# Altium schematic sheet Power.SchDoc
size Letter; Organization: Altium Limited; Address1: L3, 12a Rodborough Rd; Address2: Frenchs Forest; Address3: NSW; Address4: Australia 2086
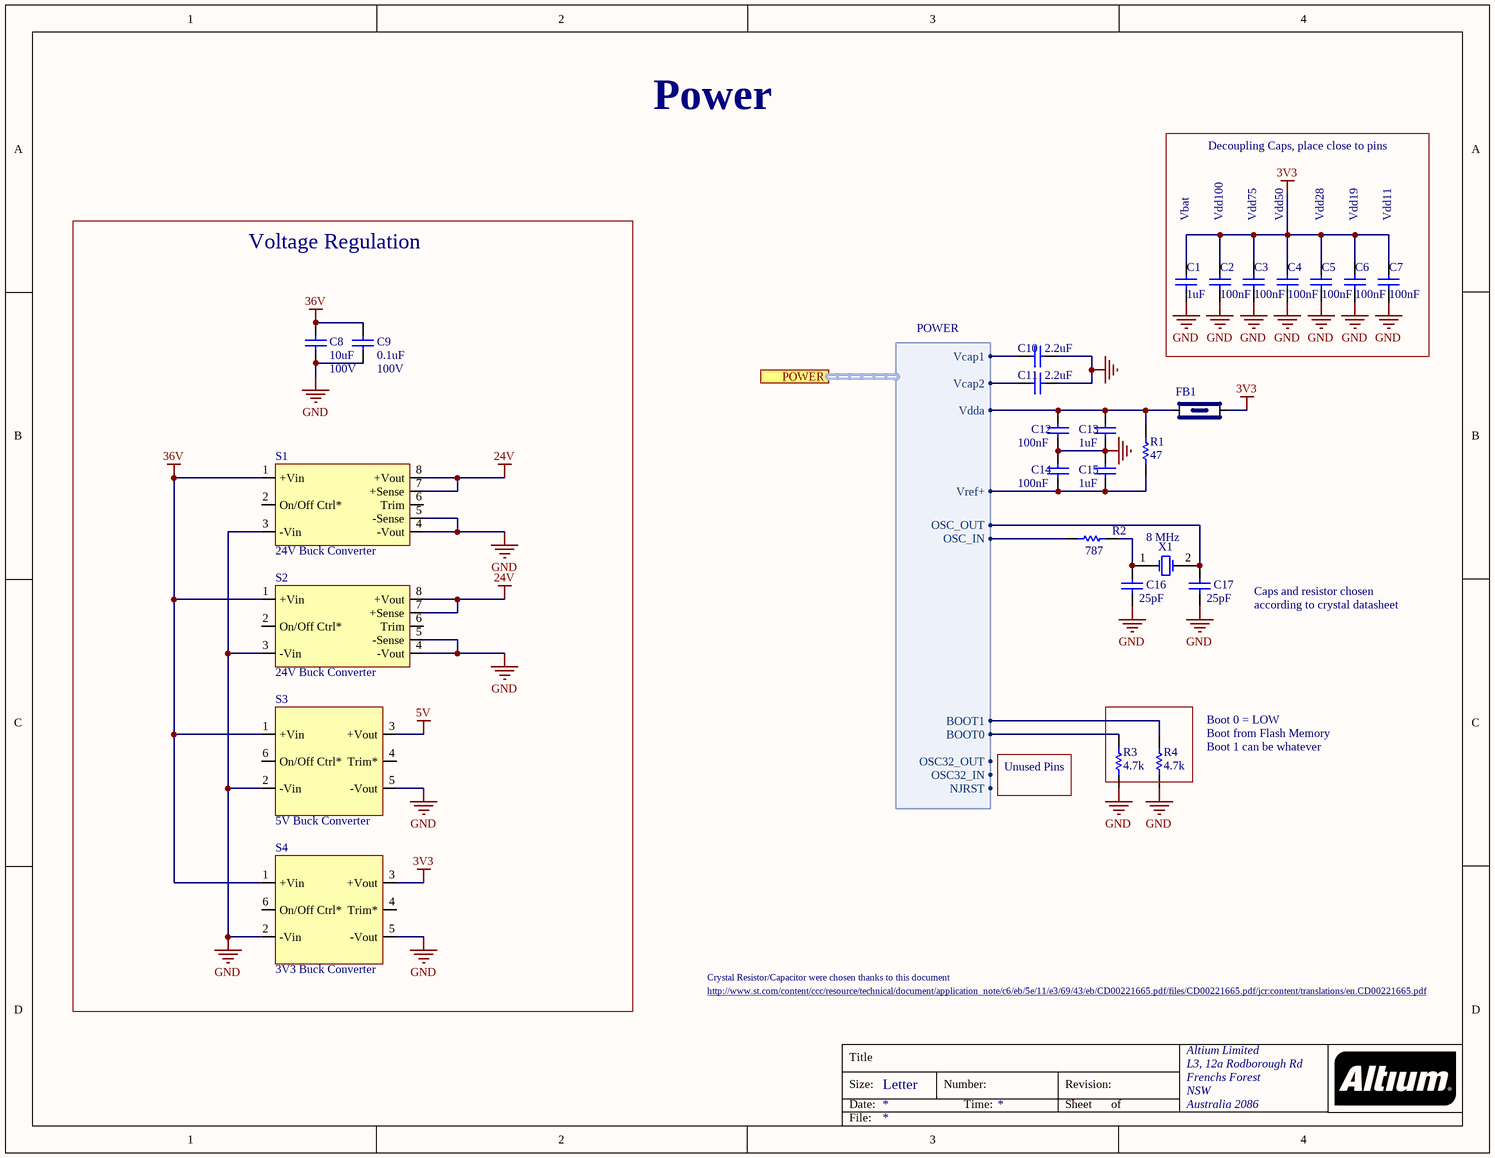
[diagram p0: Power.SchDoc]

## Parts
C1  value 1uF  [CAP_0603]
C2  value 100nF  [CAP_0603]
C3  value 100nF  [CAP_0603]
C4  value 100nF  [CAP_0603]
C5  value 100nF  [CAP_0603]
C6  value 100nF  [CAP_0603]
C7  value 100nF  [CAP_0603]
C8  value 10uF  Voltage: 100V  [2220]  (hidden comment: Cap)
C9  value 0.1uF  Voltage: 100V  [CAP_0603]  (hidden comment: Cap)
C10  value 2.2uF  [CAP_0603]
C11  value 2.2uF  [CAP_0603]
C12  value 100nF  [CAP_0603]
C13  value 1uF  [CAP_0603]
C14  value 100nF  [CAP_0603]
C15  value 1uF  [CAP_0603]
C16  value 25pF  [CAP_0603]
C17  value 25pF  [CAP_0603]
FB1  Ferrite Bead  [0603]  (value not drawn)
R1  value 47  [RES_0603]  (hidden comment: Res1)
R2  value 787  [RES_0603]  (hidden comment: Res1)
R3  value 4.7k  [RES_0603]  (hidden comment: Res1)
R4  value 4.7k  [RES_0603]  (hidden comment: Res1)
S1  24V Buck Converter  [UWE-24/3-Q12]
S2  24V Buck Converter  [UWE-24/3-Q12]
S3  5V Buck Converter  [SPM15-050-Q12P-C]
S4  3V3 Buck Converter  [SPM15-033-Q48N-C]
X1  Frequency: 8 MHz  [OSC_8MHz]  (hidden comment: XTAL)

## Blocks framed on the sheet
Voltage Regulation: C8 C9 S1-S4

## Ports
POWER (harness POWER)

## Harnesses
POWER: BOOT0, BOOT1, NJRST, OSC_IN, OSC_OUT, OSC32_IN, OSC32_OUT, Vcap1, Vcap2, Vdda, Vref+

## Nets
3V3: C1.2 C2.2 C3.2 C4.2 C5.2 C6.2 C7.2 FB1.2 S4.3(+Vout)
5V: S3.3(+Vout)
24V: S1.7(+Sense) S1.8(+Vout) S2.7(+Sense) S2.8(+Vout)
36V: C8.2 C9.2 S1.1(+Vin) S2.1(+Vin) S3.1(+Vin) S4.1(+Vin)
GND: C1.1 C2.1 C3.1 C4.1 C5.1 C6.1 C7.1 C8.1 C9.1 C10.1 C11.1 C12.1 C13.1 C14.2 C15.2 C16.1 C17.1 R3.1 R4.1 S1.3(-Vin) S1.4(-Vout) S1.5(-Sense) S2.3(-Vin) S2.4(-Vout) S2.5(-Sense) S3.2(-Vin) S3.5(-Vout) S4.2(-Vin) S4.5(-Vout)
NetC10_2: C10.2 ; port POWER.Vcap1
NetC11_2: C11.2 ; port POWER.Vcap2
NetC12_2: C12.2 C13.2 FB1.1 R1.2 ; port POWER.Vdda
NetC14_1: C14.1 C15.1 R1.1 ; port POWER.Vref+
NetC16_2: C16.2 R2.1 X1.1(OSC1)
NetC17_2: C17.2 X1.2(OSC2) ; port POWER.OSC_OUT
NetR2_2: R2.2 ; port POWER.OSC_IN
NetR3_2: R3.2 ; port POWER.BOOT0
NetR4_2: R4.2 ; port POWER.BOOT1

Not connected (* = marked no-connect by the designer): S1 2(On/Off_Ctrl*) 6(Trim); S2 2(On/Off_Ctrl*) 6(Trim); S3 4(Trim*) 6(On/Off_Ctrl*); S4 4(Trim*) 6(On/Off_Ctrl*)

## Notes on the sheet
- Power
- Decoupling Caps, place close to pins
- Vbat
- Vdd100
- Vdd75
- Vdd50
- Vdd28
- Vdd19
- Vdd11
- Caps and resistor chosen
- according to crystal datasheet
- (near R3) Unused Pins
- (near R4) Boot 0 = LOW
- (near R4) Boot from Flash Memory
- (near R4) Boot 1 can be whatever
- http://www.st.com/content/ccc/resource/technical/document/application_note/c6/eb/5e/11/e3/69/43/eb/CD00221665.pdf/files/CD00221665.pdf/jcr:content/translations/en.CD00221665.pdf
- Crystal Resistor/Capacitor were chosen thanks to this document
- Title
- Size:
- Date:
- Letter
- Number:
- Time:
- Revision:
- Sheet
- of
- File:

## Library data of the parts
C1-C17 = Cap: Capacitor
  C8 C9: Published: 8-Jun-2000; LatestRevisionDate: 17-Jul-2002; LatestRevisionNote: Re-released for DXP Platform.; PackageReference: RAD-0.3; Publisher: Altium Limited; PackageDescription: Radial Cap, Thru-Hole; 2 Leads; 0.3 in Pin Spacing
R1-R4 = Res1: Resistor
S1 S2 = UWE-24/3-Q12PB-C: CONV DC/DC 72W 24V 3A; Link: https://www.digikey.com/product-detail/en/murata-power-solutions-inc/UWE-24-3-Q12PB-C/811-2236-5-ND/2346086
S3 = SPM15-050-Q12P-C: DC/DC CONVERTER 5V 15W; Link: https://www.digikey.com/product-detail/en/murata-power-solutions-inc/SPM15-050-Q12P-C/811-2909-5-ND/4693860
S4 = SPM15-033-Q12P-C: DC/DC CONVERTER 3.3V 15W; Link: https://www.digikey.com/product-detail/en/murata-power-solutions-inc/SPM15-033-Q12P-C/811-2907-5-ND/4693858
X1 = XTAL: Crystal Oscillator